# EAGLE schematic Opentrons_smoothieboard-5driver (EAGLE 7.2.0)

## Sheet 1 of 4
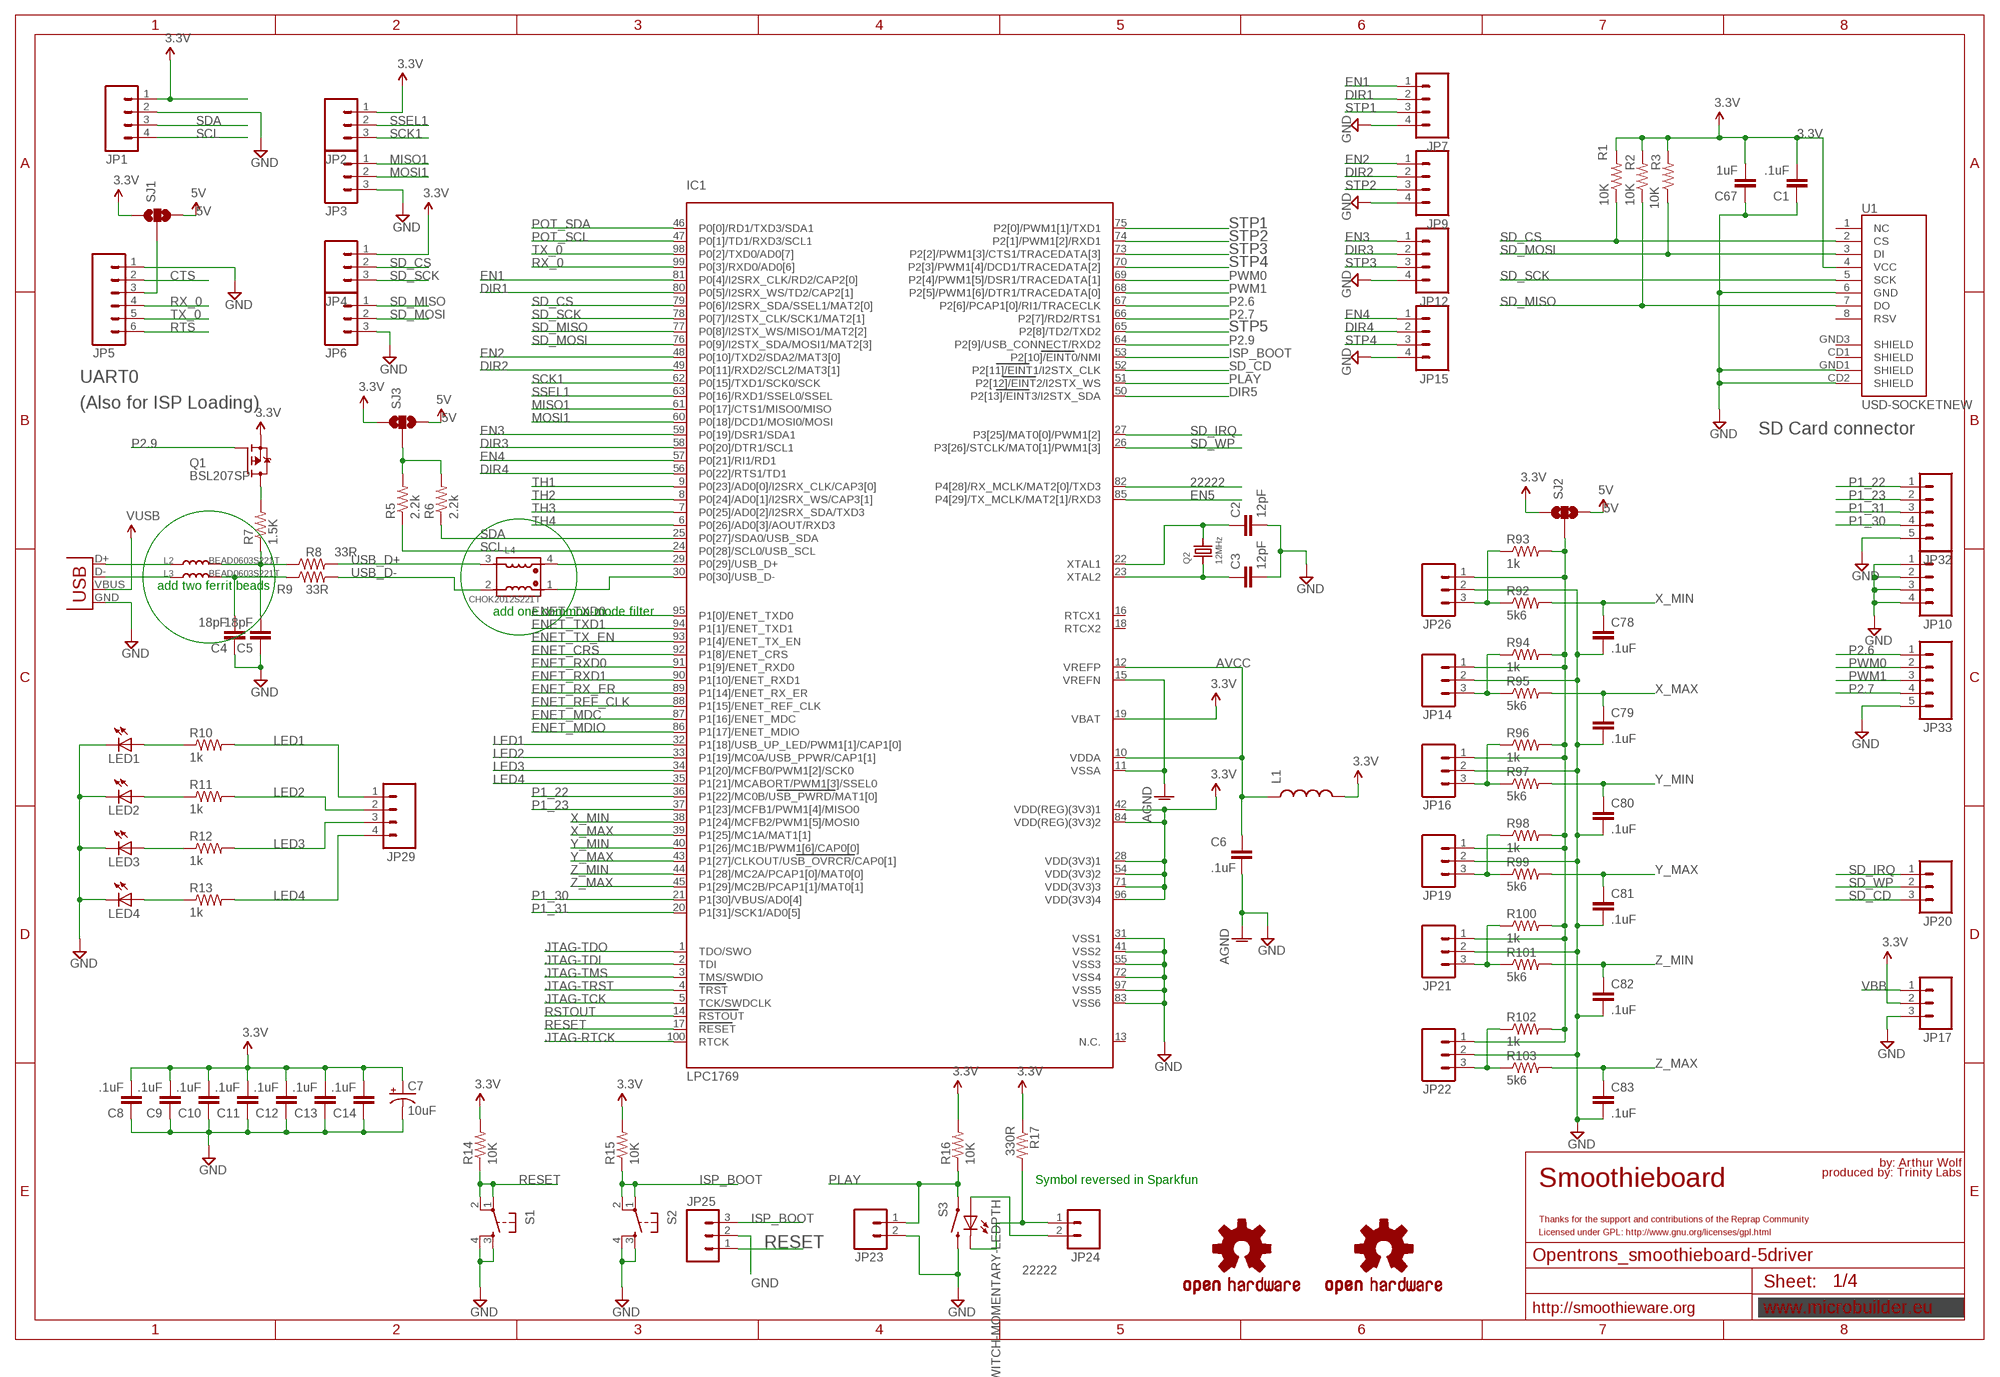
[diagram p0: schematic, sheet 1]

### Parts
C1  .1uF  C-EUC0603  [C0603]
C2  12pF  C-EUC0603  [C0603]
C3  12pF  C-EUC0603  [C0603]
C4  18pF  C-EUC0603  [C0603]
C5  18pF  C-EUC0603  [C0603]
C6  .1uF  C-EUC0603  [C0603]
C7  10uF  CAP_POL1206  [EIA3216]
C8  .1uF  C-EUC0603  [C0603]
C9  .1uF  C-EUC0603  [C0603]
C10  .1uF  C-EUC0603  [C0603]
C11  .1uF  C-EUC0603  [C0603]
C12  .1uF  C-EUC0603  [C0603]
C13  .1uF  C-EUC0603  [C0603]
C14  .1uF  C-EUC0603  [C0603]
C67  1uF  C-EUC0805  [C0805]
C78  .1uF  C-EUC0603  [C0603]
C79  .1uF  C-EUC0603  [C0603]
C80  .1uF  C-EUC0603  [C0603]
C81  .1uF  C-EUC0603  [C0603]
C82  .1uF  C-EUC0603  [C0603]
C83  .1uF  C-EUC0603  [C0603]
IC1  LPC1769  LPC1768  [LQFP100]
JP1  M041X04_NO_SILK  [1X04_NO_SILK]
JP2  M031X03_NO_SILK  [1X03_NO_SILK]
JP3  M031X03_NO_SILK  [1X03_NO_SILK]
JP4  M031X03_NO_SILK  [1X03_NO_SILK]
JP5  M06POLAR  [MOLEX-1X6]
JP6  M031X03_NO_SILK  [1X03_NO_SILK]
JP7  M041X04_NO_SILK  [1X04_NO_SILK]
JP9  M041X04_NO_SILK  [1X04_NO_SILK]
JP10  M041X04_NO_SILK  [1X04_NO_SILK]
JP12  M041X04_NO_SILK  [1X04_NO_SILK]
JP14  M03POLAR  [MOLEX-1X3]
JP15  M041X04_NO_SILK  [1X04_NO_SILK]
JP16  M03POLAR  [MOLEX-1X3]
JP17  M03PTH  [1X03]
JP19  M03POLAR  [MOLEX-1X3]
JP20  M03PTH  [1X03]
JP21  M03POLAR  [MOLEX-1X3]
JP22  M03POLAR  [MOLEX-1X3]
JP23  M02PTH  [1X02]
JP24  M02PTH  [1X02]
JP25  M03PTH  [1X03]
JP26  M03POLAR  [MOLEX-1X3]
JP29  M041X04_NO_SILK  [1X04_NO_SILK]
JP32  M05PTH  [1X05]
JP33  M05PTH  [1X05]
L1  INDUCTOR0603  [0603]
L2  BEAD0603S221T  INDOUCTOR0603  [0603(1608)]
L3  BEAD0603S221T  INDOUCTOR0603  [0603(1608)]
L4  CHOK2012S221T  CHOK-2012S-XXXT  [L-2012]
LED1  LEDCHIP-LED0805  [CHIP-LED0805]
LED2  LEDCHIP-LED0805  [CHIP-LED0805]
LED3  LEDCHIP-LED0805  [CHIP-LED0805]
LED4  LEDCHIP-LED0805  [CHIP-LED0805]
Q1  BSL207SP  [SC74_INFINEON]
Q2  12MHz  CRYSTALTHIN  [CRYSTAL_3.2X2.5]
R1  10K  R-US_R0603  [R0603]
R2  10K  R-US_R0603  [R0603]
R3  10K  R-US_R0603  [R0603]
R5  2.2k  R-US_R0603  [R0603]
R6  2.2k  R-US_R0603  [R0603]
R7  1.5K  R-US_R0603  [R0603]
R8  33R  R-US_R0603  [R0603]
R9  33R  R-US_R0603  [R0603]
R10  1k  R-US_R0603  [R0603]
R11  1k  R-US_R0603  [R0603]
R12  1k  R-US_R0603  [R0603]
R13  1k  R-US_R0603  [R0603]
R14  10K  R-US_R0603  [R0603]
R15  10K  R-US_R0603  [R0603]
R16  10K  R-US_R0603  [R0603]
R17  330R  R-US_R0603  [R0603]
R92  5k6  R-US_R0603  [R0603]
R93  1k  R-US_R0603  [R0603]
R94  1k  R-US_R0603  [R0603]
R95  5k6  R-US_R0603  [R0603]
R96  1k  R-US_R0603  [R0603]
R97  5k6  R-US_R0603  [R0603]
R98  1k  R-US_R0603  [R0603]
R99  5k6  R-US_R0603  [R0603]
R100  1k  R-US_R0603  [R0603]
R101  5k6  R-US_R0603  [R0603]
R102  1k  R-US_R0603  [R0603]
R103  5k6  R-US_R0603  [R0603]
S1  TAC_SWITCHSMD  [TACTILE_SWITCH_SMD]
S2  TAC_SWITCHSMD  [TACTILE_SWITCH_SMD]
S3  SWITCH-MOMENTARY-LEDPTH  [TACTILE-PTH-LED-12MM]
SJ1  SOLDERJUMPER_2WAYS  [SJ_3]
SJ2  SOLDERJUMPER_2WAYS  [SJ_3]
SJ3  SOLDERJUMPER_2WAYS  [SJ_3]
U1  USD-SOCKETNEW  [MICRO-SD-SOCKET-PP]
U$8  OSHW-LOGOH  [OSHW-LOGO-HUGE]
U$9  OSHW-LOGOH  [OSHW-LOGO-HUGE]
X14  USBPTH  [USB-B-PTH]

### Nets
3.3V: C1.2 C7.A(+) C8.2 C9.2 C10.2 C11.2 C12.2 C13.2 C14.2 C67.2 IC1.19(VBAT) IC1.28(VDD(3V3)1) IC1.42(VDD(REG)(3V3)1) IC1.54(VDD(3V3)2) IC1.71(VDD(3V3)3) IC1.84(VDD(REG)(3V3)2) IC1.96(VDD(3V3)4) JP1.1 JP2.1 JP4.1 JP17.2 L1.2 Q1.4(S) R1.2 R2.2 R3.2 R14.2 R15.2 R16.2 R17.1 SJ1.1 SJ2.1 SJ3.1 U1.4(VCC) ; also sheet 2,3,4
5V: SJ1.3 SJ2.3 SJ3.3 ; also sheet 3
22222: IC1.82(P4[28]/RX_MCLK/MAT2[0]/TXD3) JP24.2 S3.A
AGND: C6.2 IC1.11(VSSA) IC1.15(VREFN) ; supply symbol labelled GND ; also sheet 2
AVCC: C6.1 IC1.10(VDDA) IC1.12(VREFP) L1.1 ; also sheet 2
CTS: JP5.2
DIR1: IC1.80(P0[5]/I2SRX_WS/TD2/CAP2[1]) JP7.2 ; also sheet 2
DIR2: IC1.49(P0[11]/RXD2/SCL2/MAT3[1]) JP9.2 ; also sheet 2
DIR3: IC1.58(P0[20]/DTR1/SCL1) JP12.2 ; also sheet 2
DIR4: IC1.56(P0[22]/RTS1/TD1) JP15.2 ; also sheet 2
DIR5: IC1.50(P2[13]/EINT3/I2STX_SDA) ; also sheet 4
EN1: IC1.81(P0[4]/I2SRX_CLK/RD2/CAP2[0]) JP7.1 ; also sheet 2
EN2: IC1.48(P0[10]/TXD2/SDA2/MAT3[0]) JP9.1 ; also sheet 2
EN3: IC1.59(P0[19]/DSR1/SDA1) JP12.1 ; also sheet 2
EN4: IC1.57(P0[21]/RI1/RD1) JP15.1 ; also sheet 2
EN5: IC1.85(P4[29]/TX_MCLK/MAT2[1]/RXD3) ; also sheet 4
ENET_CRS: IC1.92(P1[8]/ENET_CRS) ; also sheet 3
ENET_MDC: IC1.87(P1[16]/ENET_MDC) ; also sheet 3
ENET_MDIO: IC1.86(P1[17]/ENET_MDIO) ; also sheet 3
ENET_REF_CLK: IC1.88(P1[15]/ENET_REF_CLK) ; also sheet 3
ENET_RX_ER: IC1.89(P1[14]/ENET_RX_ER) ; also sheet 3
ENET_RXD0: IC1.91(P1[9]/ENET_RXD0) ; also sheet 3
ENET_RXD1: IC1.90(P1[10]/ENET_RXD1) ; also sheet 3
ENET_TX_EN: IC1.93(P1[4]/ENET_TX_EN) ; also sheet 3
ENET_TXD0: IC1.95(P1[0]/ENET_TXD0) ; also sheet 3
ENET_TXD1: IC1.94(P1[1]/ENET_TXD1) ; also sheet 3
GND: C1.1 C2.2 C3.2 C4.1 C5.1 C7.C(-) C8.1 C9.1 C10.1 C11.1 C12.1 C13.1 C14.1 C67.1 C78.2 C79.2 C80.2 C81.2 C82.2 C83.2 IC1.31(VSS1) IC1.41(VSS2) IC1.55(VSS3) IC1.72(VSS4) IC1.83(VSS6) IC1.97(VSS5) JP1.2 JP3.3 JP5.1 JP6.3 JP7.4 JP9.4 JP10.1 JP10.2 JP10.3 JP10.4 JP12.4 JP14.2 JP15.4 JP16.2 JP17.3 JP19.2 JP21.2 JP22.2 JP23.2 JP25.2 JP26.2 JP32.5 JP33.5 LED1.C LED2.C LED3.C LED4.C S1.3 S1.4 S2.3 S2.4 S3.2 U1.6(GND) U1.CD2(SHIELD) U1.GND1(SHIELD) X14.GND ; also sheet 2,3,4
ISP_BOOT: IC1.53(P2[10]/EINT0/NMI) JP25.3 R15.1 S2.1 S2.2
JTAG-RTCK: IC1.100(RTCK)
JTAG-TCK: IC1.5(TCK/SWDCLK)
JTAG-TDI: IC1.2(TDI)
JTAG-TDO: IC1.1(TDO/SWO)
JTAG-TMS: IC1.3(TMS/SWDIO)
JTAG-TRST: IC1.4(TRST)
LED1: IC1.32(P1[18]/USB_UP_LED/PWM1[1]/CAP1[0]) JP29.1 R10.2
LED2: IC1.33(P1[19]/MC0A/USB_PPWR/CAP1[1]) JP29.2 R11.2
LED3: IC1.34(P1[20]/MCFB0/PWM1[2]/SCK0) JP29.3 R12.2
LED4: IC1.35(P1[21]/MCABORT/PWM1[3]/SSEL0) JP29.4 R13.2
MISO1: IC1.61(P0[17]/CTS1/MISO0/MISO) JP3.1
MOSI1: IC1.60(P0[18]/DCD1/MOSI0/MOSI) JP3.2
N$1: C2.1 IC1.22(XTAL1) Q2.2
N$2: C3.1 IC1.23(XTAL2) Q2.1
N$23: JP5.3 SJ1.2
N$51: Q1.1(D) Q1.2(D) Q1.5(D) Q1.6(D) R7.2
N$61: L2.1 X14.D+
N$62: L3.1 X14.D-
N$73: JP24.1 R17.2 S3.C
N$84: LED4.A R13.1
N$85: LED3.A R12.1
N$86: LED2.A R11.1
N$87: LED1.A R10.1
N$114: JP14.3 R94.1 R95.1
N$115: JP14.1 JP16.1 JP19.1 JP21.1 JP22.1 JP26.1 R93.2 R94.2 R96.2 R98.2 R100.2 R102.2 SJ2.2
N$116: JP16.3 R96.1 R97.1
N$117: JP19.3 R98.1 R99.1
N$118: JP22.3 R102.1 R103.1
N$119: JP21.3 R100.1 R101.1
N$122: JP26.3 R92.1 R93.1
N$124: R5.2 R6.2 SJ3.2
N$125: C5.2 L2.2 R7.1 R8.1
N$126: C4.2 L3.2 R9.1
N$128: IC1.30(P0[30]/USB_D-) L4.1
N$153: IC1.29(P0[29]/USB_D+) L4.4
P1_22: IC1.36(P1[22]/MC0B/USB_PWRD/MAT1[0]) JP32.1 ; also sheet 4
P1_23: IC1.37(P1[23]/MCFB1/PWM1[4]/MISO0) JP32.2 ; also sheet 4
P1_30: IC1.21(P1[30]/VBUS/AD0[4]) JP32.4
P1_31: IC1.20(P1[31]/SCK1/AD0[5]) JP32.3
P2.6: IC1.67(P2[6]/PCAP1[0]/RI1/TRACECLK) JP33.1 ; also sheet 3
P2.7: IC1.66(P2[7]/RD2/RTS1) JP33.4 ; also sheet 3
P2.9: IC1.64(P2[9]/USB_CONNECT/RXD2) Q1.3(G)
PLAY: IC1.51(P2[12]/EINT2/I2STX_WS) JP23.1 R16.1 S3.4
POT_SCL: IC1.47(P0[1]/TD1/RXD3/SCL1) ; also sheet 2,4
POT_SDA: IC1.46(P0[0]/RD1/TXD3/SDA1) ; also sheet 2,4
PWM0: IC1.69(P2[4]/PWM1[5]/DSR1/TRACEDATA[1]) JP33.2 ; also sheet 3
PWM1: IC1.68(P2[5]/PWM1[6]/DTR1/TRACEDATA[0]) JP33.3 ; also sheet 3
RESET: IC1.17(RESET) JP25.1 R14.1 S1.1 S1.2
RSTOUT: IC1.14(RSTOUT) ; also sheet 3
RTS: JP5.6
RX_0: IC1.99(P0[3]/RXD0/AD0[6]) JP5.4
SCK1: IC1.62(P0[15]/TXD1/SCK0/SCK) JP2.3
SCL: IC1.24(P0[28]/SCL0/USB_SCL) JP1.4 R5.1
SD_CD: IC1.52(P2[11]/EINT1/I2STX_CLK) JP20.3
SD_CS: IC1.79(P0[6]/I2SRX_SDA/SSEL1/MAT2[0]) JP4.2 R1.1 U1.2(CS)
SD_IRQ: IC1.27(P3[25]/MAT0[0]/PWM1[2]) JP20.1
SD_MISO: IC1.77(P0[8]/I2STX_WS/MISO1/MAT2[2]) JP6.1 R2.1 U1.7(DO)
SD_MOSI: IC1.76(P0[9]/I2STX_SDA/MOSI1/MAT2[3]) JP6.2 R3.1 U1.3(DI)
SD_SCK: IC1.78(P0[7]/I2STX_CLK/SCK1/MAT2[1]) JP4.3 U1.5(SCK)
SD_WP: IC1.26(P3[26]/STCLK/MAT0[1]/PWM1[3]) JP20.2
SDA: IC1.25(P0[27]/SDA0/USB_SDA) JP1.3 R6.1
SSEL1: IC1.63(P0[16]/RXD1/SSEL0/SSEL) JP2.2
STP1: IC1.75(P2[0]/PWM1[1]/TXD1) JP7.3 ; also sheet 2
STP2: IC1.74(P2[1]/PWM1[2]/RXD1) JP9.3 ; also sheet 2
STP3: IC1.73(P2[2]/PWM1[3]/CTS1/TRACEDATA[3]) JP12.3 ; also sheet 2
STP4: IC1.70(P2[3]/PWM1[4]/DCD1/TRACEDATA[2]) JP15.3 ; also sheet 2
STP5: IC1.65(P2[8]/TD2/TXD2) ; also sheet 4
TH1: IC1.9(P0[23]/AD0[0]/I2SRX_CLK/CAP3[0]) ; also sheet 2
TH2: IC1.8(P0[24]/AD0[1]/I2SRX_WS/CAP3[1]) ; also sheet 2
TH3: IC1.7(P0[25]/AD0[2]/I2SRX_SDA/TXD3) ; also sheet 2
TH4: IC1.6(P0[26]/AD0[3]/AOUT/RXD3) ; also sheet 2
TX_0: IC1.98(P0[2]/TXD0/AD0[7]) JP5.5
USB_D+: L4.3 R8.2
USB_D-: L4.2 R9.2
VBB: JP17.1 ; also sheet 2,3,4
VUSB: X14.VBUS ; also sheet 3
X_MAX: C79.1 IC1.39(P1[25]/MC1A/MAT1[1]) R95.2
X_MIN: C78.1 IC1.38(P1[24]/MCFB2/PWM1[5]/MOSI0) R92.2
Y_MAX: C81.1 IC1.43(P1[27]/CLKOUT/USB_OVRCR/CAP0[1]) R99.2
Y_MIN: C80.1 IC1.40(P1[26]/MC1B/PWM1[6]/CAP0[0]) R97.2
Z_MAX: C83.1 IC1.45(P1[29]/MC2B/PCAP1[1]/MAT0[1]) R103.2
Z_MIN: C82.1 IC1.44(P1[28]/MC2A/PCAP1[0]/MAT0[0]) R101.2
Unconnected: IC1.13(N.C.) IC1.16(RTCX1) IC1.18(RTCX2) U1.1(NC) U1.8(RSV) U1.CD1(SHIELD) U1.GND3(SHIELD)

### Notes on the sheet
- UART0
- (Also for ISP Loading)
- SD Card connector
- add two ferrit beads
- add one common-mode filter
- by: Arthur Wolf
- produced by: Trinity Labs
- Symbol reversed in Sparkfun | Smoothieboard
- Thanks for the support and contributions of the Reprap Community
- Licensed under GPL: http://www.gnu.org/licenses/gpl.html
- http://smoothieware.org

## Sheet 2 of 4
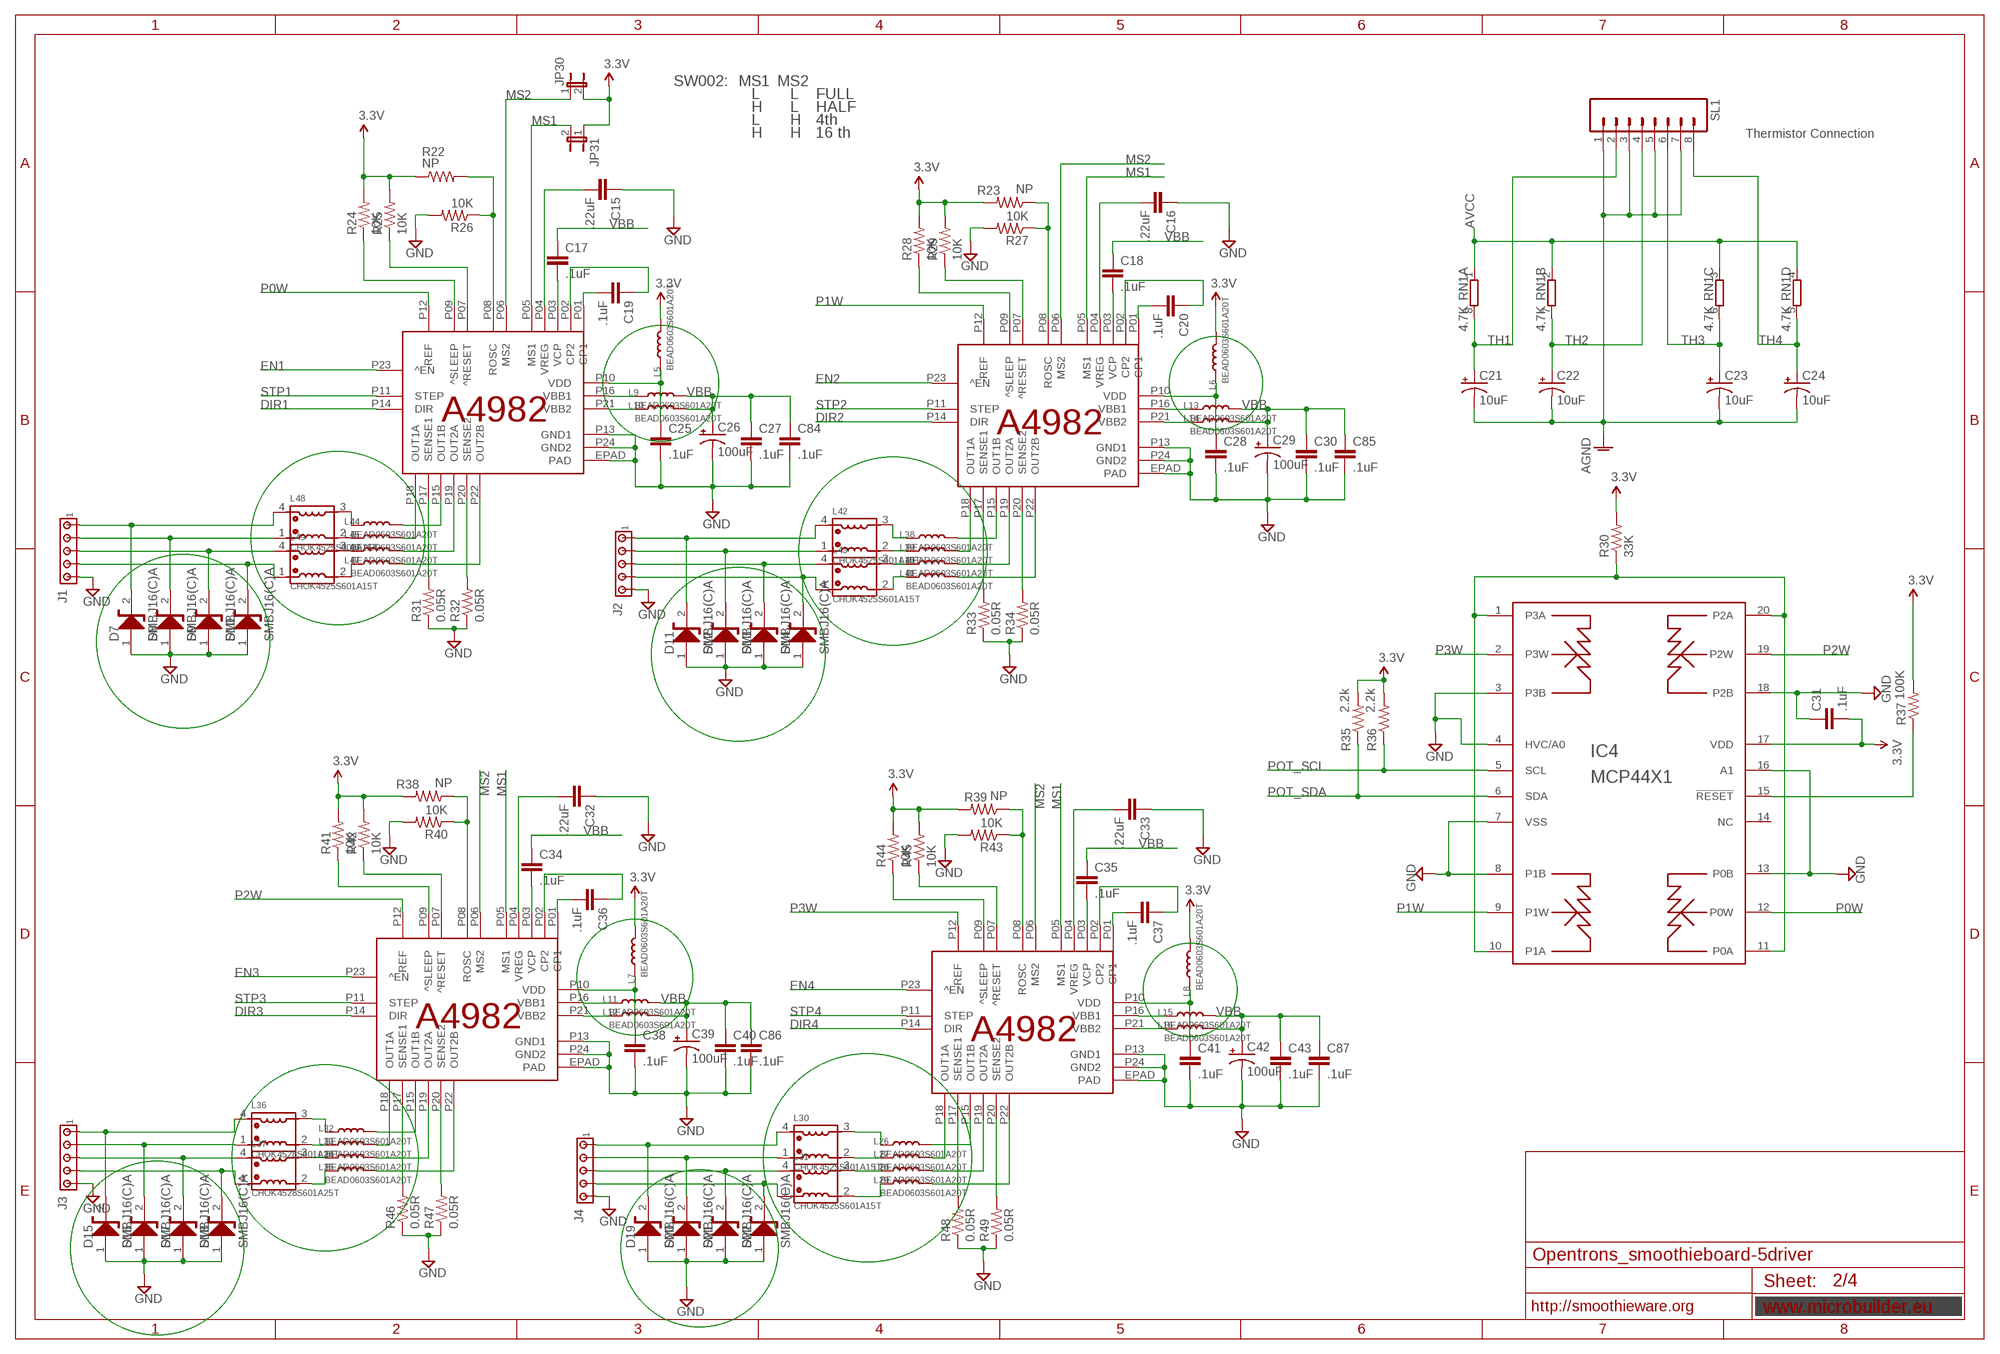
[diagram p1: schematic, sheet 2]

### Parts
C15  .22uF  C-EUC0603  [C0603]
C16  .22uF  C-EUC0603  [C0603]
C17  .1uF  C-EUC0603  [C0603]
C18  .1uF  C-EUC0603  [C0603]
C19  .1uF  C-EUC0603  [C0603]
C20  .1uF  C-EUC0603  [C0603]
C21  10uF  CAP_POL1206  [EIA3216]
C22  10uF  CAP_POL1206  [EIA3216]
C23  10uF  CAP_POL1206  [EIA3216]
C24  10uF  CAP_POL1206  [EIA3216]
C25  .1uF  C-EUC0603  [C0603]
C26  100uF  CAP_POLE  [PANASONIC_E]
C27  .1uF  C-EUC0603  [C0603]
C28  .1uF  C-EUC0603  [C0603]
C29  100uF  CAP_POLE  [PANASONIC_E]
C30  .1uF  C-EUC0603  [C0603]
C31  .1uF  C-EUC0603  [C0603]
C32  .22uF  C-EUC0603  [C0603]
C33  .22uF  C-EUC0603  [C0603]
C34  .1uF  C-EUC0603  [C0603]
C35  .1uF  C-EUC0603  [C0603]
C36  .1uF  C-EUC0603  [C0603]
C37  .1uF  C-EUC0603  [C0603]
C38  .1uF  C-EUC0603  [C0603]
C39  100uF  CAP_POLE  [PANASONIC_E]
C40  .1uF  C-EUC0603  [C0603]
C41  .1uF  C-EUC0603  [C0603]
C42  100uF  CAP_POLE  [PANASONIC_E]
C43  .1uF  C-EUC0603  [C0603]
C84  .1uF  C-EUC0603  [C0603]
C85  .1uF  C-EUC0603  [C0603]
C86  .1uF  C-EUC0603  [C0603]
C87  .1uF  C-EUC0603  [C0603]
D7  SMBJ16(C)A  [DO214-AA_(SMB)]
D8  SMBJ16(C)A  [DO214-AA_(SMB)]
D9  SMBJ16(C)A  [DO214-AA_(SMB)]
D10  SMBJ16(C)A  [DO214-AA_(SMB)]
D11  SMBJ16(C)A  [DO214-AA_(SMB)]
D12  SMBJ16(C)A  [DO214-AA_(SMB)]
D13  SMBJ16(C)A  [DO214-AA_(SMB)]
D14  SMBJ16(C)A  [DO214-AA_(SMB)]
D15  SMBJ16(C)A  [DO214-AA_(SMB)]
D16  SMBJ16(C)A  [DO214-AA_(SMB)]
D17  SMBJ16(C)A  [DO214-AA_(SMB)]
D18  SMBJ16(C)A  [DO214-AA_(SMB)]
D19  SMBJ16(C)A  [DO214-AA_(SMB)]
D20  SMBJ16(C)A  [DO214-AA_(SMB)]
D21  SMBJ16(C)A  [DO214-AA_(SMB)]
D22  SMBJ16(C)A  [DO214-AA_(SMB)]
IC2  A4982  [ETSSOP24]
IC3  A4982  [ETSSOP24]
IC4  MCP44X1  [TSSOP20]
IC5  A4982  [ETSSOP24]
IC6  A4982  [ETSSOP24]
J1  MTA05-100  [10X05MTA]
J2  MTA05-100  [10X05MTA]
J3  MTA05-100  [10X05MTA]
J4  MTA05-100  [10X05MTA]
JP30  JUMPER-2SMD-NC  [SJ_2S]
JP31  JUMPER-2SMD-NC  [SJ_2S]
L5  BEAD0603S601A20T  INDOUCTOR0603  [0603(1608)]
L6  BEAD0603S601A20T  INDOUCTOR0603  [0603(1608)]
L7  BEAD0603S601A20T  INDOUCTOR0603  [0603(1608)]
L8  BEAD0603S601A20T  INDOUCTOR0603  [0603(1608)]
L9  BEAD0603S601A20T  INDOUCTOR0603  [0603(1608)]
L10  BEAD0603S601A20T  INDOUCTOR0603  [0603(1608)]
L11  BEAD0603S601A20T  INDOUCTOR0603  [0603(1608)]
L12  BEAD0603S601A20T  INDOUCTOR0603  [0603(1608)]
L13  BEAD0603S601A20T  INDOUCTOR0603  [0603(1608)]
L14  BEAD0603S601A20T  INDOUCTOR0603  [0603(1608)]
L15  BEAD0603S601A20T  INDOUCTOR0603  [0603(1608)]
L16  BEAD0603S601A20T  INDOUCTOR0603  [0603(1608)]
L26  BEAD0603S601A20T  INDOUCTOR0603  [0603(1608)]
L27  BEAD0603S601A20T  INDOUCTOR0603  [0603(1608)]
L28  BEAD0603S601A20T  INDOUCTOR0603  [0603(1608)]
L29  BEAD0603S601A20T  INDOUCTOR0603  [0603(1608)]
L30  CHOK4525S601A15T  CHOK-4525S-XXX  [L-4525]
L31  CHOK4525S601A15T  CHOK-4525S-XXX  [L-4525]
L32  BEAD0603S601A20T  INDOUCTOR0603  [0603(1608)]
L33  BEAD0603S601A20T  INDOUCTOR0603  [0603(1608)]
L34  BEAD0603S601A20T  INDOUCTOR0603  [0603(1608)]
L35  BEAD0603S601A20T  INDOUCTOR0603  [0603(1608)]
L36  CHOK4528S601A25T  CHOK-4528S-XXX  [L-4528]
L37  CHOK4528S601A25T  CHOK-4528S-XXX  [L-4528]
L38  BEAD0603S601A20T  INDOUCTOR0603  [0603(1608)]
L39  BEAD0603S601A20T  INDOUCTOR0603  [0603(1608)]
L40  BEAD0603S601A20T  INDOUCTOR0603  [0603(1608)]
L41  BEAD0603S601A20T  INDOUCTOR0603  [0603(1608)]
L42  CHOK4525S601A15T  CHOK-4525S-XXX  [L-4525]
L43  CHOK4525S601A15T  CHOK-4525S-XXX  [L-4525]
L44  BEAD0603S601A20T  INDOUCTOR0603  [0603(1608)]
L45  BEAD0603S601A20T  INDOUCTOR0603  [0603(1608)]
L46  BEAD0603S601A20T  INDOUCTOR0603  [0603(1608)]
L47  BEAD0603S601A20T  INDOUCTOR0603  [0603(1608)]
L48  CHOK4525S601A15T  CHOK-4525S-XXX  [L-4525]
L49  CHOK4525S601A15T  CHOK-4525S-XXX  [L-4525]
R22  NP  R-US_R0603  [R0603]
R23  NP  R-US_R0603  [R0603]
R24  10K  R-US_R0603  [R0603]
R25  10K  R-US_R0603  [R0603]
R26  10K  R-US_R0603  [R0603]
R27  10K  R-US_R0603  [R0603]
R28  10K  R-US_R0603  [R0603]
R29  10K  R-US_R0603  [R0603]
R30  33K  R-US_R0603  [R0603]
R31  0.05R  RESISTOR2512  [R2512]
R32  0.05R  RESISTOR2512  [R2512]
R33  0.05R  RESISTOR2512  [R2512]
R34  0.05R  RESISTOR2512  [R2512]
R35  2.2k  R-US_R0603  [R0603]
R36  2.2k  R-US_R0603  [R0603]
R37  100K  R-US_R0603  [R0603]
R38  NP  R-US_R0603  [R0603]
R39  NP  R-US_R0603  [R0603]
R40  10K  R-US_R0603  [R0603]
R41  10K  R-US_R0603  [R0603]
R42  10K  R-US_R0603  [R0603]
R43  10K  R-US_R0603  [R0603]
R44  10K  R-US_R0603  [R0603]
R45  10K  R-US_R0603  [R0603]
R46  0.05R  RESISTOR2512  [R2512]
R47  0.05R  RESISTOR2512  [R2512]
R48  0.05R  RESISTOR2512  [R2512]
R49  0.05R  RESISTOR2512  [R2512]
RN1  4.7K  4R-N0603-ARV  [0603-ARV]
SL1  M08  [08P]

### Nets
3.3V: C31.2 IC4.17(VDD) JP30.2 JP31.1 L5.2 L6.2 L7.2 L8.2 R22.1 R23.2 R24.2 R25.2 R28.2 R29.2 R30.2 R35.2 R36.2 R37.2 R38.2 R39.2 R41.2 R42.2 R44.2 R45.2 ; also sheet 1,3,4
AGND: C21.C(-) C22.C(-) C23.C(-) C24.C(-) SL1.1 SL1.3 SL1.5 SL1.7 ; also sheet 1
AVCC: RN1.1 RN1.2 RN1.3 RN1.4 ; also sheet 1
DIR1: IC2.P14(DIR) ; also sheet 1
DIR2: IC3.P14(DIR) ; also sheet 1
DIR3: IC5.P14(DIR) ; also sheet 1
DIR4: IC6.P14(DIR) ; also sheet 1
EN1: IC2.P23(^EN) ; also sheet 1
EN2: IC3.P23(^EN) ; also sheet 1
EN3: IC5.P23(^EN) ; also sheet 1
EN4: IC6.P23(^EN) ; also sheet 1
GND: C15.1 C16.1 C25.2 C26.- C27.2 C28.2 C29.- C30.2 C31.1 C32.1 C33.1 C38.2 C39.- C40.2 C41.2 C42.- C43.2 C84.2 C85.2 C86.2 C87.2 D7.1(A) D8.1(A) D9.1(A) D10.1(A) D11.1(A) D12.1(A) D13.1(A) D14.1(A) D15.1(A) D16.1(A) D17.1(A) D18.1(A) D19.1(A) D20.1(A) D21.1(A) D22.1(A) IC2.EPAD(PAD) IC2.P13(GND1) IC2.P24(GND2) IC3.EPAD(PAD) IC3.P13(GND1) IC3.P24(GND2) IC4.3(P3B) IC4.4(HVC/A0) IC4.7(VSS) IC4.8(P1B) IC4.13(P0B) IC4.16(A1) IC4.18(P2B) IC5.EPAD(PAD) IC5.P13(GND1) IC5.P24(GND2) IC6.EPAD(PAD) IC6.P13(GND1) IC6.P24(GND2) J1.5 J2.5 J3.5 J4.5 R26.2 R27.2 R31.1 R32.1 R33.1 R34.1 R40.2 R43.2 R46.1 R47.1 R48.1 R49.1 ; also sheet 1,3,4
J1_1A: D7.2(K) J1.1 L48.4
J1_1B: D8.2(K) J1.2 L48.1
J1_2A: D9.2(K) J1.3 L49.4
J1_2B: D10.2(K) J1.4 L49.1
J2_1A: D11.2(K) J2.1 L42.4
J2_1B: D12.2(K) J2.2 L42.1
J2_2A: D13.2(K) J2.3 L43.4
J2_2B: D14.2(K) J2.4 L43.1
J3_1A: D15.2(K) J3.1 L36.4
J3_1B: D16.2(K) J3.2 L36.1
J3_2A: D17.2(K) J3.3 L37.4
J3_2B: D18.2(K) J3.4 L37.1
J4_1A: D19.2(K) J4.1 L30.4
J4_1B: D20.2(K) J4.2 L30.1
J4_2A: D21.2(K) J4.3 L31.4
J4_2B: D22.2(K) J4.4 L31.1
MS1: IC2.P05(MS1) IC3.P05(MS1) IC5.P05(MS1) IC6.P05(MS1) JP31.2 ; also sheet 4
MS2: IC2.P06(MS2) IC3.P06(MS2) IC5.P06(MS2) IC6.P06(MS2) JP30.1 ; also sheet 4
N$3: C20.2 IC3.P01(CP1)
N$4: C20.1 IC3.P02(CP2)
N$6: IC2.P07(^RESET) R25.1
N$7: C18.2 IC3.P03(VCP)
N$8: IC3.P17(SENSE1) R33.2
N$9: IC3.P20(SENSE2) R34.2
N$10: IC3.P18(OUT1A) L39.2
N$12: IC3.P19(OUT2A) L40.2
N$13: IC4.15(!RESET) R37.1
N$14: IC3.P22(OUT2B) L41.2
N$15: IC4.1(P3A) IC4.10(P1A) IC4.11(P0A) IC4.20(P2A) R30.1
N$17: IC3.P08(ROSC) R23.1 R27.1
N$22: C16.2 IC3.P04(VREG)
N$24: IC3.P09(^SLEEP) R28.1
N$25: C36.2 IC5.P01(CP1)
N$26: C36.1 IC5.P02(CP2)
N$27: C34.2 IC5.P03(VCP)
N$28: IC5.P17(SENSE1) R46.2
N$30: IC5.P20(SENSE2) R47.2
N$31: IC5.P18(OUT1A) L33.2
N$32: IC5.P15(OUT1B) L32.2
N$33: IC5.P19(OUT2A) L34.2
N$34: IC5.P22(OUT2B) L35.2
N$35: IC3.P07(^RESET) R29.1
N$36: IC5.P07(^RESET) R42.1
N$37: IC5.P08(ROSC) R38.1 R40.1
N$38: C32.2 IC5.P04(VREG)
N$39: IC6.P07(^RESET) R45.1
N$40: IC5.P09(^SLEEP) R41.1
N$41: C37.2 IC6.P01(CP1)
N$43: C37.1 IC6.P02(CP2)
N$44: C35.2 IC6.P03(VCP)
N$45: IC6.P17(SENSE1) R48.2
N$46: IC6.P20(SENSE2) R49.2
N$48: IC6.P15(OUT1B) L26.2
N$49: IC6.P19(OUT2A) L28.2
N$50: IC6.P22(OUT2B) L29.2
N$53: IC6.P08(ROSC) R39.1 R43.1
N$54: C33.2 IC6.P04(VREG)
N$57: IC6.P09(^SLEEP) R44.1
N$60: IC6.P18(OUT1A) L27.2
N$90: C19.2 IC2.P01(CP1)
N$93: C19.1 IC2.P02(CP2)
N$96: C17.2 IC2.P03(VCP)
N$98: IC2.P17(SENSE1) R31.2
N$99: IC2.P20(SENSE2) R32.2
N$101: IC2.P18(OUT1A) L45.2
N$102: IC2.P15(OUT1B) L44.2
N$103: IC2.P19(OUT2A) L46.2
N$104: IC2.P22(OUT2B) L47.2
N$106: IC2.P08(ROSC) R22.2 R26.1
N$107: C15.2 IC2.P04(VREG)
N$108: IC2.P09(^SLEEP) R24.1
N$129: C25.1 IC2.P10(VDD) L5.1
N$130: C38.1 IC5.P10(VDD) L7.1
N$131: C28.1 IC3.P10(VDD) L6.1
N$132: C41.1 IC6.P10(VDD) L8.1
N$133: IC2.P16(VBB1) L9.1
N$134: IC2.P21(VBB2) L10.1
N$135: IC3.P16(VBB1) L13.1
N$136: IC3.P21(VBB2) L14.1
N$137: IC5.P16(VBB1) L11.1
N$138: IC5.P21(VBB2) L12.1
N$139: IC6.P16(VBB1) L15.1
N$140: IC6.P21(VBB2) L16.1
N$154: L26.1 L30.3
N$155: L27.1 L30.2
N$156: L28.1 L31.3
N$157: L29.1 L31.2
N$160: L33.1 L36.2
N$161: L34.1 L37.3
N$166: L32.1 L36.3
N$167: L35.1 L37.2
N$170: IC3.P15(OUT1B) L38.2
N$172: L40.1 L43.3
N$173: L39.1 L42.2
N$174: L41.1 L43.2
N$175: L38.1 L42.3
N$176: L45.1 L48.2
N$177: L46.1 L49.3
N$182: L44.1 L48.3
N$183: L47.1 L49.2
P0W: IC2.P12(REF) IC4.12(P0W)
P1W: IC3.P12(REF) IC4.9(P1W)
P2W: IC4.19(P2W) IC5.P12(REF)
P3W: IC4.2(P3W) IC6.P12(REF)
POT_SCL: IC4.5(SCL) R36.1 ; also sheet 1,4
POT_SDA: IC4.6(SDA) R35.1 ; also sheet 1,4
STP1: IC2.P11(STEP) ; also sheet 1
STP2: IC3.P11(STEP) ; also sheet 1
STP3: IC5.P11(STEP) ; also sheet 1
STP4: IC6.P11(STEP) ; also sheet 1
TH1: C21.A(+) RN1.8 SL1.2 ; also sheet 1
TH2: C22.A(+) RN1.7 SL1.4 ; also sheet 1
TH3: C23.A(+) RN1.6 SL1.6 ; also sheet 1
TH4: C24.A(+) RN1.5 SL1.8 ; also sheet 1
VBB: C17.1 C18.1 C26.+ C27.1 C29.+ C30.1 C34.1 C35.1 C39.+ C40.1 C42.+ C43.1 C84.1 C85.1 C86.1 C87.1 L9.2 L10.2 L11.2 L12.2 L13.2 L14.2 L15.2 L16.2 ; also sheet 1,3,4
Unconnected: IC4.14(NC)

### Notes on the sheet
- SW002: | MS1 | MS2
- L | L | FULL
- H | L | HALF
- L | H | 4th
- H | H | 16 th | Thermistor Connection
- http://smoothieware.org

## Sheet 3 of 4
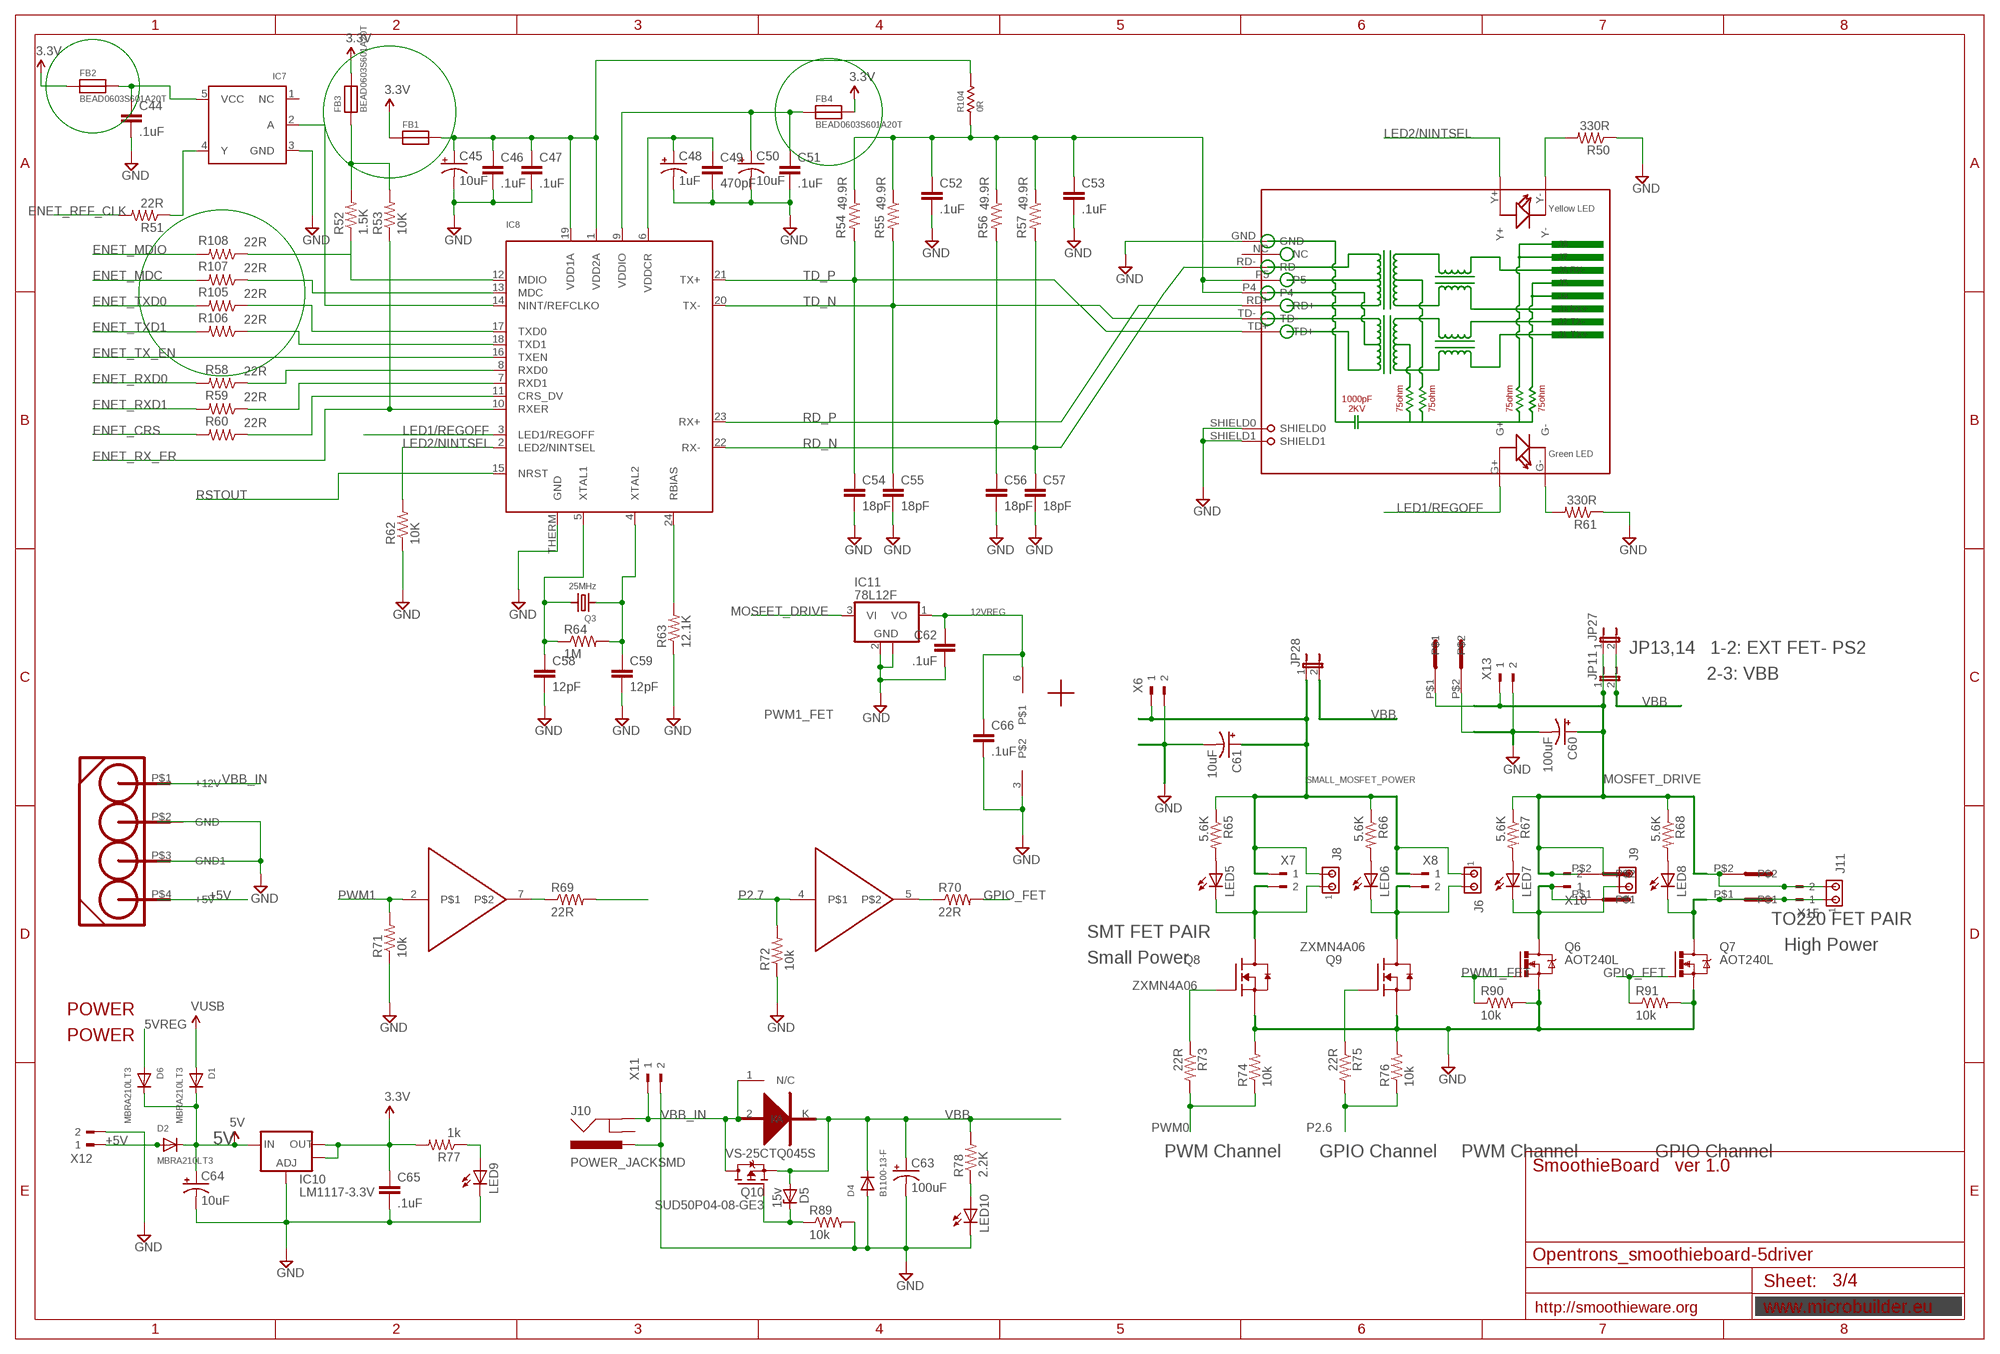
[diagram p2: schematic, sheet 3]

### Parts
C44  .1uF  C-EUC0603  [C0603]
C45  10uF  CAP_POL1206  [EIA3216]
C46  .1uF  C-EUC0603  [C0603]
C47  .1uF  C-EUC0603  [C0603]
C48  1uF  CAP_POL1206  [EIA3216]
C49  470pF  C-EUC0603K  [C0603K]
C50  10uF  CAP_POL1206  [EIA3216]
C51  .1uF  C-EUC0603  [C0603]
C52  .1uF  C-EUC0603  [C0603]
C53  .1uF  C-EUC0603  [C0603]
C54  18pF  C-EUC0603  [C0603]
C55  18pF  C-EUC0603  [C0603]
C56  18pF  C-EUC0603  [C0603]
C57  18pF  C-EUC0603  [C0603]
C58  12pF  C-EUC0603  [C0603]
C59  12pF  C-EUC0603  [C0603]
C60  100uF  CAP_POLE  [PANASONIC_E]
C61  10uF  CAP_POL1206  [EIA3216]
C62  .1uF  C-EUC0603  [C0603]
C63  100uF  CAP_POLD  [PANASONIC_D]
C64  10uF  CAP_POL1206  [EIA3216]
C65  .1uF  C-EUC0603  [C0603]
C66  .1uF  C-EUC0603  [C0603]
D1  MBRA210LT3  DIODESMA  [SMADIODE]
D2  MBRA210LT3  DIODESMA  [SMADIODE]
D3  VS-25CTQ045S  ETH1506S  [TO263AB]
D4  B1100-13-F  DIODESMA  [SMADIODE]
D5  15v  ZENER-DIODESMB  [SMB]
D6  MBRA210LT3  DIODESMA  [SMADIODE]
FB1  FERRITE  [0603]
FB2  BEAD0603S601A20T  FERRITE  [0603]
FB3  BEAD0603S601A20T  FERRITE  [0603]
FB4  BEAD0603S601A20T  FERRITE  [0603]
IC7  74LVC1G04  [SOT23-5]
IC8  LAN8720  [QFN24_4MM]
IC10  LM1117-3.3V  V_REG_LM1117SOT223  [SOT223]
IC11  78L12F  [SOT89]
IC14  TC4427  [SOIC8]
J6  MTA02-100  [10X02MTA]
J8  MTA02-100  [10X02MTA]
J9  MTA02-100  [10X02MTA]
J10  POWER_JACKSMD  [POWER_JACK_SMD]
J11  MTA02-100  [10X02MTA]
JP11  JP1E  [JP1]
JP27  JP1E  [JP1]
JP28  JP1E  [JP1]
LED5  LEDCHIP-LED0805  [CHIP-LED0805]
LED6  LEDCHIP-LED0805  [CHIP-LED0805]
LED7  LEDCHIP-LED0805  [CHIP-LED0805]
LED8  LEDCHIP-LED0805  [CHIP-LED0805]
LED9  LEDCHIP-LED0805  [CHIP-LED0805]
LED10  LEDCHIP-LED0805  [CHIP-LED0805]
POWER  POWER  HDD-ATX_CON  [MOLEX8981]
Q3  25MHz  CRYSTALTHIN  [CRYSTAL_3.2X2.5]
Q6  AOT240L  IRF540  [TO220BV]
Q7  AOT240L  IRF540  [TO220BV]
Q8  ZXMN4A06  MOSFET-NCH_SOT-223  [SOT230P700X160-4N]
Q9  ZXMN4A06  MOSFET-NCH_SOT-223  [SOT230P700X160-4N]
Q10  SUD50P04-08-GE3  SPD30P06PTO252  [TO252]
R50  330R  R-US_R0603  [R0603]
R51  22R  R-US_R0603  [R0603]
R52  1.5K  R-US_R0603  [R0603]
R53  10K  R-US_R0603  [R0603]
R54  49.9R  R-US_R0603  [R0603]
R55  49.9R  R-US_R0603  [R0603]
R56  49.9R  R-US_R0603  [R0603]
R57  49.9R  R-US_R0603  [R0603]
R58  22R  R-US_R0603  [R0603]
R59  22R  R-US_R0603  [R0603]
R60  22R  R-US_R0603  [R0603]
R61  330R  R-US_R0603  [R0603]
R62  10K  R-US_R0603  [R0603]
R63  12.1K  R-US_R0603  [R0603]
R64  1M  R-US_R0603  [R0603]
R65  5.6K  R-US_R0603  [R0603]
R66  5.6K  R-US_R0603  [R0603]
R67  5.6K  R-US_R0603  [R0603]
R68  5.6K  R-US_R0603  [R0603]
R69  22R  R-US_R0603  [R0603]
R70  22R  R-US_R0603  [R0603]
R71  10k  R-US_R0603  [R0603]
R72  10k  R-US_R0603  [R0603]
R73  22R  R-US_R0603  [R0603]
R74  10k  R-US_R0603  [R0603]
R75  22R  R-US_R0603  [R0603]
R76  10k  R-US_R0603  [R0603]
R77  1k  R-US_R0603  [R0603]
R78  2.2K  R-US_R0603  [R0603]
R89  10k  R-US_R0603  [R0603]
R90  10k  R-US_R0603  [R0603]
R91  10k  R-US_R0603  [R0603]
R104  0R  RES0603  [0603(1608)]
R105  22R  R-US_R0603  [R0603]
R106  22R  R-US_R0603  [R0603]
R107  22R  R-US_R0603  [R0603]
R108  22R  R-US_R0603  [R0603]
RJ1  HR911105A  [HR911105A]
U$5  5MMCONN  [1715250000]
U$6  5MMCONN  [1715250000]
U$10  5MMCONN  [1715250000]
X6  180G-2  [180G-2]
X7  180G-2  [180G-2]
X8  180G-2  [180G-2]
X10  180G-2  [180G-2]
X11  180G-2  [180G-2]
X12  180G-2  [180G-2]
X13  180G-2  [180G-2]
X15  180G-2  [180G-2]

### Nets
3.3V: C65.1 FB1.1 FB2.1 FB3.2 FB4.2 IC10.2(OUT) IC10.4(OUT) R77.2 ; also sheet 1,2,4
5V: C64.A(+) D1.C D2.C D6.C IC10.3(IN) ; also sheet 1
5VREG: D6.A ; also sheet 4
12VREG: C62.1 C66.1 IC11.1(VO) IC14.6 ; also sheet 4
+5V: D2.A POWER.P$4(+5V) X12.1
ENET_CRS: R60.2 ; also sheet 1
ENET_MDC: R107.2 ; also sheet 1
ENET_MDIO: R108.2 ; also sheet 1
ENET_REF_CLK: R51.2 ; also sheet 1
ENET_RX_ER: IC8.10(RXER) R53.1 ; also sheet 1
ENET_RXD0: R58.2 ; also sheet 1
ENET_RXD1: R59.2 ; also sheet 1
ENET_TX_EN: IC8.16(TXEN) ; also sheet 1
ENET_TXD0: R105.2 ; also sheet 1
ENET_TXD1: R106.2 ; also sheet 1
GND: C44.2 C45.C(-) C46.2 C47.2 C48.C(-) C49.2 C50.C(-) C51.2 C52.2 C53.2 C54.2 C55.2 C56.2 C57.2 C58.2 C59.2 C60.- C61.C(-) C62.2 C63.- C64.C(-) C65.2 C66.2 D4.A IC7.3(GND) IC8.THERM(GND) IC10.1(ADJ) IC11.2(GND) IC11.2@1(GND) IC14.3 J10.VIN0(PWR) LED9.C LED10.C POWER.P$2(GND) POWER.P$3(GND1) Q6.S Q7.S Q8.3(S) Q9.3(S) R50.1 R61.1 R62.1 R63.1 R71.1 R72.1 R74.2 R76.2 R89.2 R90.2 R91.2 RJ1.GND RJ1.SHIELD0 RJ1.SHIELD1 U$5.P$2 X6.2 X11.2 X12.2 X13.2 ; also sheet 1,2,4
GPIO_FET: Q7.G R70.2 R91.1
LED1/REGOFF: IC8.3(LED1/REGOFF) RJ1.G+
LED2/NINTSEL: IC8.2(LED2/NINTSEL) R62.2 RJ1.Y+
MOSFET_DRIVE: C60.+ IC11.3(VI) J9.2 J11.2 JP11.1 JP27.1 R67.1 R68.1 U$5.P$1 U$6.P$2 U$10.P$2 X10.2 X13.1 X15.2
N$5: IC14.7 R69.1
N$16: LED10.A R78.1
N$18: J6.2 LED6.C Q9.4(D) X8.2
N$19: IC14.5 R70.1
N$20: R61.2 RJ1.G-
N$21: C52.1 C53.1 R54.1 R55.1 R56.1 R57.1 R104.1 RJ1.P4 RJ1.P5
N$42: IC8.8(RXD0) R58.1
N$47: R50.2 RJ1.Y-
N$55: IC8.7(RXD1) R59.1
N$63: IC8.11(CRS_DV) R60.1
N$67: C59.1 IC8.4(XTAL2) Q3.1 R64.2
N$68: C58.1 IC8.5(XTAL1) Q3.2 R64.1
N$69: IC8.24(RBIAS) R63.2
N$74: Q8.1(G) R73.1
N$75: Q9.1(G) R75.1
N$77: IC7.2(A) IC8.14(NINT/REFCLKO)
N$78: IC7.4(Y) R51.1
N$80: LED9.A R77.1
N$81: LED5.A R65.2
N$82: C48.A(+) C49.1 IC8.6(VDDCR)
N$88: J8.1 LED5.C Q8.4(D) X7.2
N$91: LED6.A R66.2
N$92: J9.1 LED7.C Q6.D U$10.P$1 X10.1
N$94: J11.1 LED8.C Q7.D U$6.P$1 X15.1
N$105: LED7.A R67.2
N$111: D5.C Q10.1(G) R89.1
N$112: LED8.A R68.2
N$144: C44.1 FB2.2 IC7.5(VCC)
N$147: FB3.1 R52.2 R53.2
N$148: C50.A(+) C51.1 FB4.1 IC8.9(VDDIO)
N$149: C45.A(+) C46.1 C47.1 FB1.2 IC8.1(VDD2A) IC8.19(VDD1A) R104.2
N$162: IC8.17(TXD0) R105.1
N$163: IC8.18(TXD1) R106.1
N$164: IC8.12(MDIO) R52.1 R108.1
N$165: IC8.13(MDC) R107.1
P2.6: R75.2 R76.1 ; also sheet 1
P2.7: IC14.4 R72.2 ; also sheet 1
PWM0: R73.2 R74.1 ; also sheet 1
PWM1: IC14.2 R71.2 ; also sheet 1
PWM1_FET: Q6.G R69.2 R90.1
RD_N: C57.1 IC8.22(RX-) R57.2 RJ1.RD-
RD_P: C56.1 IC8.23(RX+) R56.2 RJ1.RD+
RSTOUT: IC8.15(NRST) ; also sheet 1
SMALL_MOSFET_POWER: C61.A(+) J6.1 J8.2 JP28.1 R65.1 R66.1 X6.1 X7.1 X8.1
TD_N: C55.1 IC8.20(TX-) R55.2 RJ1.TD-
TD_P: C54.1 IC8.21(TX+) R54.2 RJ1.TD+
VBB: C63.+ D3.K D4.C D5.A JP11.2 JP27.2 JP28.2 Q10.2(S) R78.2 ; also sheet 1,2,4
VBB_IN: D3.1(N/C) D3.2(A) J10.P$4(GND) POWER.P$1(+12V) Q10.3(D) X11.1
VUSB: D1.A ; also sheet 1
Unconnected: IC7.1(NC) J10.GND(GNDBREAK) RJ1.NC

### Notes on the sheet
- JP13,14   1-2: EXT FET- PS2
- 2-3: VBB
- TO220 FET PAIR
- SMT FET PAIR
- High Power
- Small Power
- VS-25CTQ045S | PWM Channel | GPIO Channel | PWM Channel | GPIO Channel
- SmoothieBoard   ver 1.0
- http://smoothieware.org

## Sheet 4 of 4
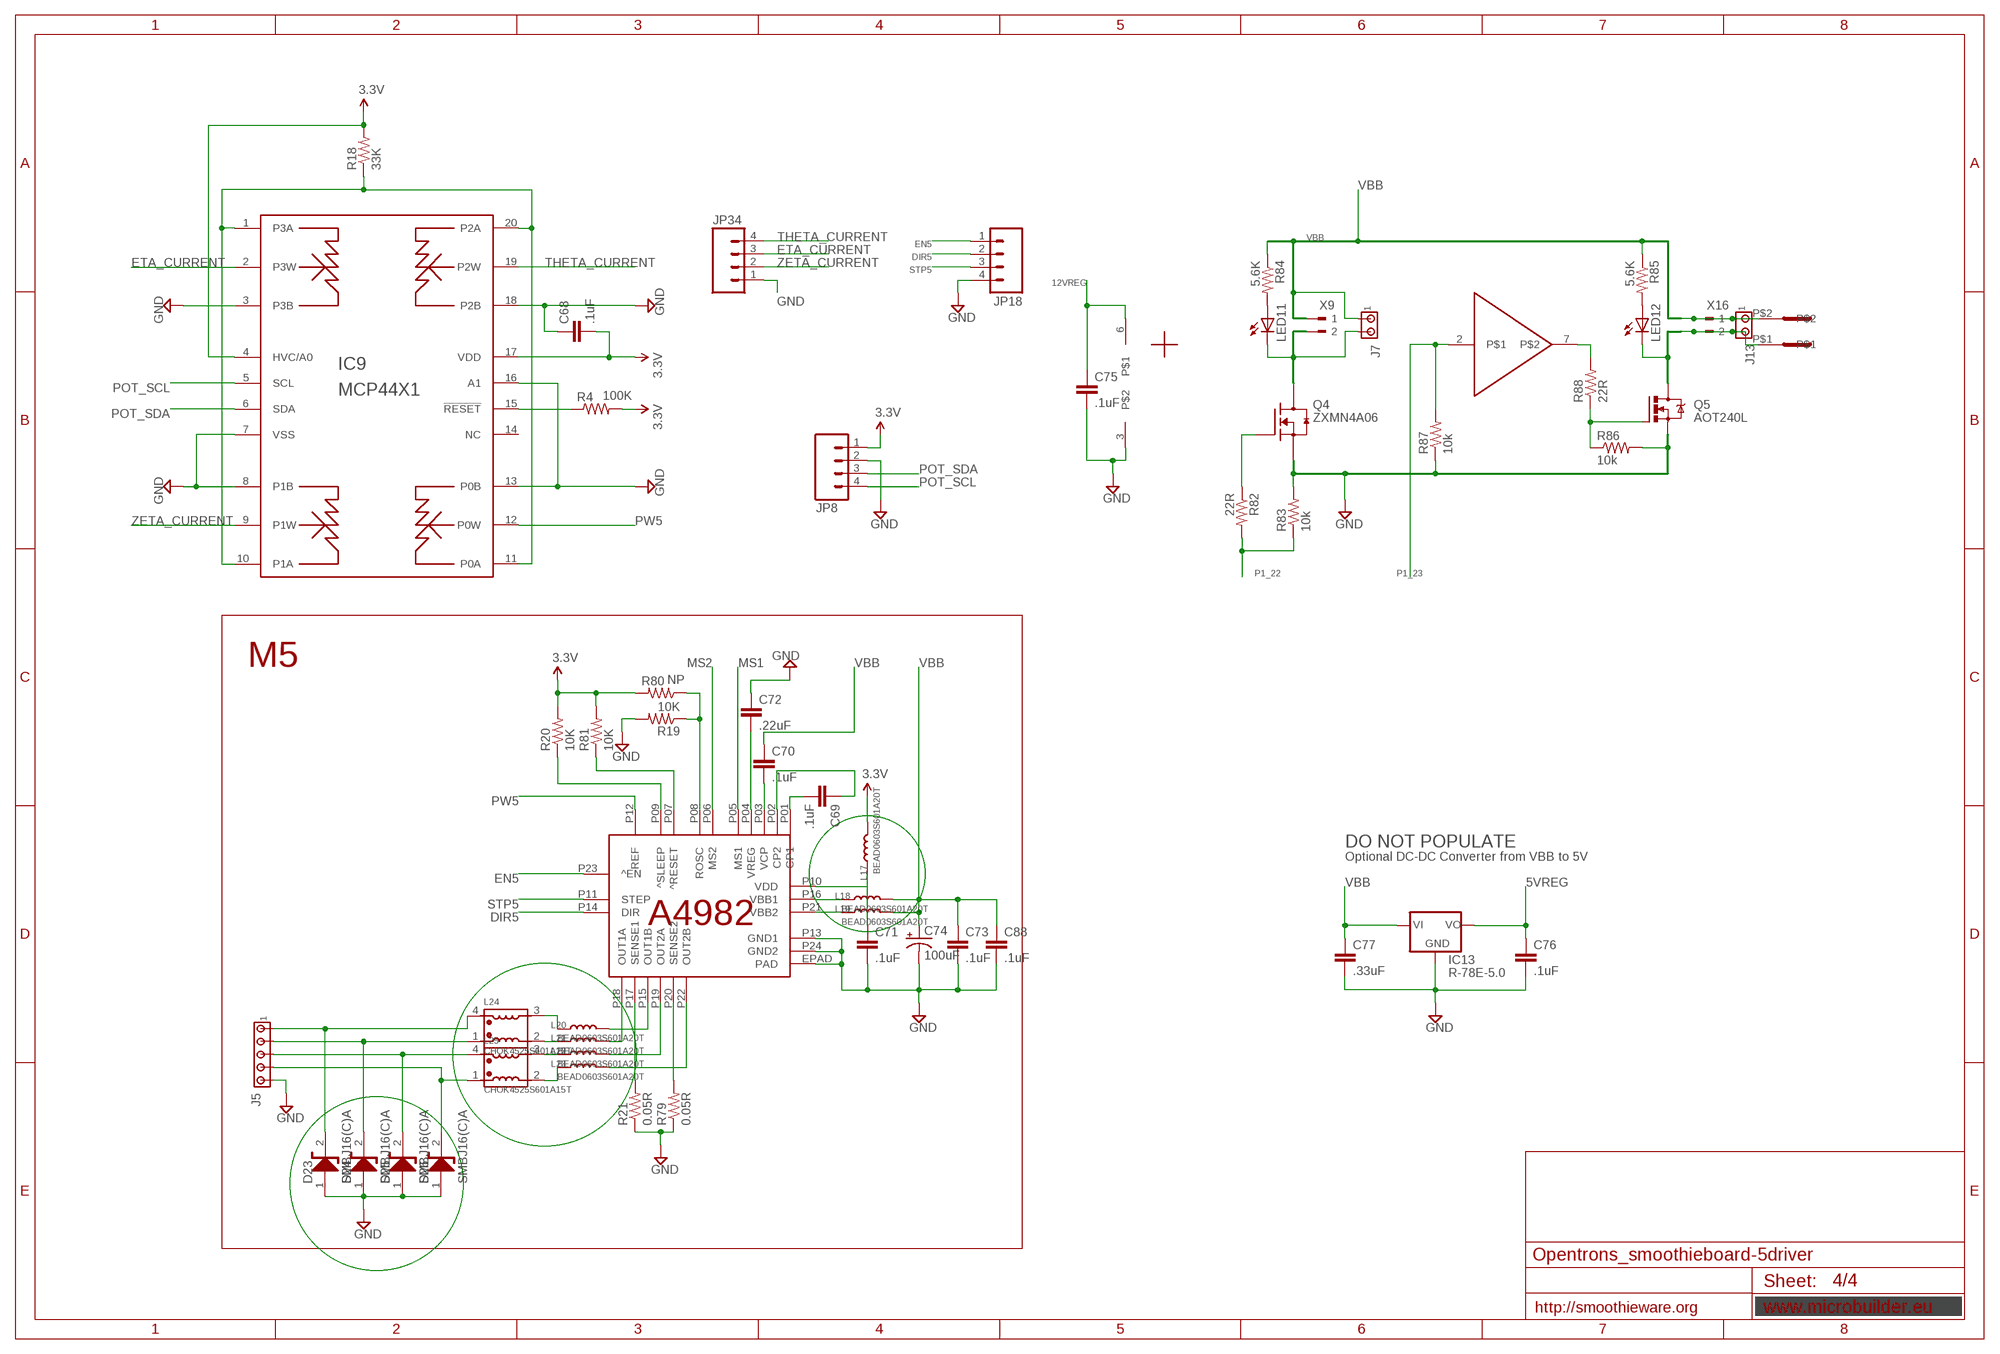
[diagram p3: schematic, sheet 4]

### Parts
C68  .1uF  C-EUC0603  [C0603]
C69  .1uF  C-EUC0603  [C0603]
C70  .1uF  C-EUC0603  [C0603]
C71  .1uF  C-EUC0603  [C0603]
C72  .22uF  C-EUC0603  [C0603]
C73  .1uF  C-EUC0603  [C0603]
C74  100uF  CAP_POLE  [PANASONIC_E]
C75  .1uF  C-EUC0603  [C0603]
C76  .1uF  C-EUC0603  [C0603]
C77  .33uF  C-EUC0603  [C0603]
C88  .1uF  C-EUC0603  [C0603]
D23  SMBJ16(C)A  [DO214-AA_(SMB)]
D24  SMBJ16(C)A  [DO214-AA_(SMB)]
D25  SMBJ16(C)A  [DO214-AA_(SMB)]
D26  SMBJ16(C)A  [DO214-AA_(SMB)]
IC9  MCP44X1  [TSSOP20]
IC12  A4982  [ETSSOP24]
IC13  R-78E-5.0  R-78  [R-78]
IC15  TC4427  [SOIC8]
J5  MTA05-100  [10X05MTA]
J7  MTA02-100  [10X02MTA]
J13  MTA02-100  [10X02MTA]
JP8  M041X04_NO_SILK  [1X04_NO_SILK]
JP18  M041X04_NO_SILK  [1X04_NO_SILK]
JP34  M041X04_NO_SILK  [1X04_NO_SILK]
L17  BEAD0603S601A20T  INDOUCTOR0603  [0603(1608)]
L18  BEAD0603S601A20T  INDOUCTOR0603  [0603(1608)]
L19  BEAD0603S601A20T  INDOUCTOR0603  [0603(1608)]
L20  BEAD0603S601A20T  INDOUCTOR0603  [0603(1608)]
L21  BEAD0603S601A20T  INDOUCTOR0603  [0603(1608)]
L22  BEAD0603S601A20T  INDOUCTOR0603  [0603(1608)]
L23  BEAD0603S601A20T  INDOUCTOR0603  [0603(1608)]
L24  CHOK4525S601A15T  CHOK-4525S-XXX  [L-4525]
L25  CHOK4525S601A15T  CHOK-4525S-XXX  [L-4525]
LED11  LEDCHIP-LED0805  [CHIP-LED0805]
LED12  LEDCHIP-LED0805  [CHIP-LED0805]
Q4  ZXMN4A06  MOSFET-NCH_SOT-223  [SOT230P700X160-4N]
Q5  AOT240L  IRF540  [TO220BV]
R4  100K  R-US_R0603  [R0603]
R18  33K  R-US_R0603  [R0603]
R19  10K  R-US_R0603  [R0603]
R20  10K  R-US_R0603  [R0603]
R21  0.05R  RESISTOR2512  [R2512]
R79  0.05R  RESISTOR2512  [R2512]
R80  NP  R-US_R0603  [R0603]
R81  10K  R-US_R0603  [R0603]
R82  22R  R-US_R0603  [R0603]
R83  10k  R-US_R0603  [R0603]
R84  5.6K  R-US_R0603  [R0603]
R85  5.6K  R-US_R0603  [R0603]
R86  10k  R-US_R0603  [R0603]
R87  10k  R-US_R0603  [R0603]
R88  22R  R-US_R0603  [R0603]
U$7  5MMCONN  [1715250000]
X9  180G-2  [180G-2]
X16  180G-2  [180G-2]

### Nets
3.3V: C68.2 IC9.4(HVC/A0) IC9.17(VDD) JP8.1 L17.2 R4.2 R18.2 R20.2 R80.2 R81.2 ; also sheet 1,2,3
5VREG: C76.1 IC13.3(VO) ; also sheet 3
12VREG: C75.1 IC15.6 ; also sheet 3
DIR5: IC12.P14(DIR) JP18.2 ; also sheet 1
EN5: IC12.P23(^EN) JP18.1 ; also sheet 1
ETA_CURRENT: IC9.2(P3W) JP34.3
GND: C68.1 C71.2 C72.1 C73.2 C74.- C75.2 C76.2 C77.2 C88.2 D23.1(A) D24.1(A) D25.1(A) D26.1(A) IC9.3(P3B) IC9.7(VSS) IC9.8(P1B) IC9.13(P0B) IC9.16(A1) IC9.18(P2B) IC12.EPAD(PAD) IC12.P13(GND1) IC12.P24(GND2) IC13.2(GND) IC15.3 J5.5 JP8.2 JP18.4 JP34.1 Q4.3(S) Q5.S R19.2 R21.1 R79.1 R83.2 R86.2 R87.1 ; also sheet 1,2,3
GPIO_FET1: Q5.G R86.1 R88.1
J5_1A: D23.2(K) J5.1 L24.4
J5_1B: D24.2(K) J5.2 L24.1
J5_2A: D25.2(K) J5.3 L25.4
J5_2B: D26.2(K) J5.4 L25.1
MS1: IC12.P05(MS1) ; also sheet 2
MS2: IC12.P06(MS2) ; also sheet 2
N$29: IC9.15(!RESET) R4.1
N$52: J7.2 LED11.C Q4.4(D) X9.2
N$56: IC9.1(P3A) IC9.10(P1A) IC9.11(P0A) IC9.20(P2A) R18.1
N$58: C69.2 IC12.P01(CP1)
N$59: C69.1 IC12.P02(CP2)
N$64: C70.2 IC12.P03(VCP)
N$65: IC12.P17(SENSE1) R21.2
N$66: IC12.P20(SENSE2) R79.2
N$70: IC12.P18(OUT1A) L21.2
N$71: IC12.P15(OUT1B) L20.2
N$72: IC12.P19(OUT2A) L22.2
N$76: IC12.P22(OUT2B) L23.2
N$79: IC12.P08(ROSC) R19.1 R80.1
N$83: C72.2 IC12.P04(VREG)
N$89: IC12.P09(^SLEEP) R20.1
N$95: IC12.P07(^RESET) R81.1
N$97: Q4.1(G) R82.1
N$100: LED11.A R84.2
N$109: J13.2 LED12.C Q5.D U$7.P$1 X16.2
N$110: LED12.A R85.2
N$113: IC15.7 R88.2
N$141: C71.1 IC12.P10(VDD) L17.1
N$142: IC12.P16(VBB1) L18.1
N$143: IC12.P21(VBB2) L19.1
N$145: L21.1 L24.2
N$146: L20.1 L24.3
N$150: L22.1 L25.3
N$151: L23.1 L25.2
P1_22: R82.2 R83.1 ; also sheet 1
P1_23: IC15.2 R87.2 ; also sheet 1
POT_SCL: IC9.5(SCL) JP8.4 ; also sheet 1,2
POT_SDA: IC9.6(SDA) JP8.3 ; also sheet 1,2
PW5: IC9.12(P0W) IC12.P12(REF)
STP5: IC12.P11(STEP) JP18.3 ; also sheet 1
THETA_CURRENT: IC9.19(P2W) JP34.4
VBB: C70.1 C73.1 C74.+ C77.1 C88.1 IC13.1(VI) J7.1 J13.1 L18.2 L19.2 R84.1 R85.1 U$7.P$2 X9.1 X16.1 ; also sheet 1,2,3
ZETA_CURRENT: IC9.9(P1W) JP34.2
Unconnected: IC9.14(NC) IC15.4 IC15.5

### Notes on the sheet
- M5
- DO NOT POPULATE
- Optional DC-DC Converter from VBB to 5V
- http://smoothieware.org

## Library data of the parts
C1 C44 C46 C47 C49 C51-C59 C62 C65-C67 C75 = resistor:C-EU: CAPACITOR, European symbol
C2-C6 C8-C20 C25 C27 C28 C30-C38 C40 C41 C43 C68-C73 C76-C88 = rcl:C-EU: CAPACITOR, European symbol
C7 C21-C24 C26 C29 C39 C42 C45 C48 C50 C60 C61 C63 C64 C74 = SparkFun:CAP_POL: Capacitor Polarized These are standard SMD and PTH capacitors. Normally 10uF, 47uF, and 100uF in electrolytic and tantalum varieties. Always verify the external diameter of the through hole cap, it varies with capacity, voltage, and manufacturer. The EIA devices should be standard.
D1 D2 D4 D6 = microbuilder:DIODE: Diode SMADIODE - SMA Surface Mount Package 20V 1A Schottky Diode Digikey (500mV @ 1A, 500uA Vr @ 20V): 641-1014-6-ND 10V 2A Schottky Diode Digikey (350mV @ 2A, 700uA Vr @ 10V): MBRA210LT3 SOD-123 30V 200mA (800mV Vf, 2uA Vr @ 25V) Schottky Diode (very fast switching for boost, etc.) - Digikey: BAT54T1GOSTR-ND 30V 500mA (430mV Vf, 130uA Vr @ 30V) Schottky Diode - Digikey: B0530W-FDICT-ND MBR120 1A 20V (0.34Vf) Schottky Diode - Digikey: MBR120VLSFT1GOSCT-ND SOD-323 10V 570mA (380mV Vf, 3ns) Schottky Diode - Digikey: ZLLS410CT-ND 1N4148WS - 75V 150mA (1V Vf @ 10mA, 4ns) Simple Diode - Digikey: 1N4148WSFSCT-ND, Mouser: 512-1N4148WS SOD-523 BAT54 30V 200mA Schottky (0.8 Vf @ 100mA, 5ns) - Digikey: BAT54XV2CT-ND 30V 30mA Schottky Diode (RB751S-40TE61) - Digikey: RB751S-40TE61CT-ND SOT23-R/W - SOT23 Package (R = Solder Paste/Reflow Ovens, W = Hand-Soldering) BAT54Film 40V 300mA - Digikey: 497-7162-1-ND DO-1N4148 Through Hole Small Current Diode (any model)
D3 = Geos:ETH1506S: ETH1506S Package : TO-263AB (D2PAK), TO-262AA IF(AV) : 15 A VR : 600 V Hyperfast Rectifier, 15 A FRED Pt Diode variation Single die
D5 = diode:ZENER-DIODE: Z-Diode
D7-D26 = My_Lib:SMBJ16
FB1-FB4 = microbuilder:FERRITE: Ferrite Bead 0603 MMZ1608B121C - 120 Ohm, 600mA Ferrite Chip - Digikey: 445-2164-1-ND BK1608HW121-T - 120 Ohm, 600mA Ferrite Chip - Digikey: 587-1876-2-ND
IC1 = microbuilder:LPC1768: LPC1768 100 MHz 32-bit ARM Cortex-M3 based microcontroller featuring a high level of integration and low power consumption. 512 kB Flash, 64 kB SRAM, USB Device/Host/OTG, Ethernet, CAN, I2S, 10-bit DAC Digikey: 568-4796-ND
IC2 IC3 IC5 IC6 IC12 = A4982:A4982
IC4 IC9 = Geos:MCP44X1: MCP44x1 MCP4451 - ? Quad Resistor Network ? I2C Serial Interface Support ? Potentiometer or Rheostat Configuration Options ? Resistor Network Resolution: 7-bit ? 128 Resistors (129 Taps) 8-bit ? 256 Resistors (257 Taps)
IC7 = microbuilder:74LVC1G04: 74LVC1G04 - Single Inverter Gate SOT23-5 SN74LVC1G04DBVR - Digikey: 296-11599-1-ND
IC8 = microbuilder:LAN8720: LAN8720A 10/100 Ethernet PHY Mouser: 886-LAN8720AI-CP
IC10 = SparkFun:V_REG_LM1117: Voltage Regulator LM1117 Standard adjustable voltage regulator but in SMD form. Spark Fun Electronics SKU : COM-00595
IC11 = linear:78L*: POSITOIV-VOLTAGE REGULATORS Output up to 100 mA Source: http://focus.ti.com/lit/ds/symlink/ua78l05.pdf
IC13 = logxen:R-78
IC14 IC15 = custom_esorensen:TC4427
J1-J5 = con-amp:MTA05-100: AMP connector
J6-J9 J11 J13 = con-amp:MTA02-100: AMP connector
J10 = SparkFun:POWER_JACK: Power Jack This is the standard 5.5mm barrel jack for power. The PTH is the most common, proven, reliable, footprint. All others are experimental. The Slot footprint only works if the mill layer is transmitted to the PCB fab house so be warned. Spark Fun Electronics SKU : PRT-00119. Mating wall wart : TOL-00298 (and others)
JP1 JP7-JP10 JP12 JP15 JP18 JP29 JP34 = SparkFun:M04: Header 4 Standard 4-pin 0.1" header. Use with straight break away headers (SKU : PRT-00116), right angle break away headers (PRT-00553), swiss pins (PRT-00743), machine pins (PRT-00117), and female headers (PRT-00115). Molex polarized connector foot print use with SKU : PRT-08231 with associated crimp pins and housings. 1MM SMD Version SKU: PRT-10208
JP2-JP4 JP6 JP14 JP16 JP17 JP19-JP22 JP26 = SparkFun:M03: Header 3 Standard 3-pin 0.1" header. Use with straight break away headers (SKU : PRT-00116), right angle break away headers (PRT-00553), swiss pins (PRT-00743), machine pins (PRT-00117), and female headers (PRT-00115). Molex polarized connector foot print use with SKU : PRT-08232 with associated crimp pins and housings.
JP5 = SparkFun:M06: Header 6 Standard 6-pin 0.1" header. Use with straight break away headers (SKU : PRT-00116), right angle break away headers (PRT-00553), swiss pins (PRT-00743), machine pins (PRT-00117), and female headers (PRT-00115). Molex polarized connector foot print use with SKU : PRT-08094 with associated crimp pins and housings. NOTES ON THE VARIANTS LOCK and LOCK_LONGPADS... This footprint was designed to help hold the alignment of a through-hole component (i.e. 6-pin header) while soldering it into place. You may notice that each hole has been shifted either up or down by 0.005 of an inch from it's more standard position (which is a perfectly straight line). This slight alteration caused the pins (the squares in the middle) to touch the edges of the holes. Because they are alternating, it causes a "brace" to hold the component in place. 0.005 has proven to be the perfect amount of "off-center" position when using our standard breakaway headers. Although looks a little odd when you look at the bare footprint, once you have a header in there, the alteration is very hard to notice. Also, if you push a header all the way into place, it is covered up entirely on the bottom side. This idea of altering the position of holes to aid alignment will be further integrated into the Sparkfun Library for other footprints. It can help hold any component with 3 or more connection pins.
JP11 JP27 JP28 = jumper:JP1E: JUMPER
JP23 JP24 = SparkFun:M02: Header 2 Standard 2-pin 0.1" header. Use with straight break away headers (SKU : PRT-00116), right angle break away headers (PRT-00553), swiss pins (PRT-00743), machine pins (PRT-00117), and female headers (PRT-00115). Molex polarized connector foot print use with SKU : PRT-08233 with associated crimp pins and housings.
JP25 = SparkFun-Connectors:M03: Header 3 Standard 3-pin 0.1" header. Use with straight break away headers (SKU : PRT-00116), right angle break away headers (PRT-00553), swiss pins (PRT-00743), machine pins (PRT-00117), and female headers (PRT-00115). Molex polarized connector foot print use with SKU : PRT-08232 with associated crimp pins and housings.
JP30 JP31 = SparkFun:JUMPER-2: Jumper Basic 0.1" spaced jumper. Use with breakaway headers.
JP32 JP33 = SparkFun:M05: Header 5 Standard 5-pin 0.1" header. Use with straight break away headers (SKU : PRT-00116), right angle break away headers (PRT-00553), swiss pins (PRT-00743), machine pins (PRT-00117), and female headers (PRT-00115). Molex polarized connector foot print use with SKU : PRT-08230 with associated crimp pins and housings.
L1 = SparkFun:INDUCTOR: Inductors Basic Inductor/Choke - 0603 and 1206. Footprints are not proven and vary greatly between part numbers.
L2 L3 L5-L23 L26-L29 L32-L35 L38-L41 L44-L47 = My_Lib:INDOUCTOR
L4 L24 L25 L30 L31 L36 L37 L42 L43 L48 L49 = My_Lib:CHOK-
LED1-LED12 = led:LED: LED OSRAM: - CHIPLED LG R971, LG N971, LY N971, LG Q971, LY Q971, LO R971, LY R971 LH N974, LH R974 LS Q976, LO Q976, LY Q976 LO Q996 - Hyper CHIPLED LW Q18S LB Q993, LB Q99A, LB R99A - SideLED LS A670, LO A670, LY A670, LG A670, LP A670 LB A673, LV A673, LT A673, LW A673 LH A674 LY A675 LS A676, LA A676, LO A676, LY A676, LW A676 LS A679, LY A679, LG A679 - Hyper Micro SIDELED® LS Y876, LA Y876, LO Y876, LY Y876 LT Y87S - SmartLED LW L88C, LW L88S LB L89C, LB L89S, LG L890 LS L89K, LO L89K, LY L89K LS L896, LA L896, LO L896, LY L896 - TOPLED LS T670, LO T670, LY T670, LG T670, LP T670 LSG T670, LSP T670, LSY T670, LOP T670, LYG T670 LG T671, LOG T671, LSG T671 LB T673, LV T673, LT T673, LW T673 LH T674 LS T676, LA T676, LO T676, LY T676, LB T676, LH T676, LSB T676, LW T676 LB T67C, LV T67C, LT T67C, LS T67K, LO T67K, LY T67K, LW E67C LS E67B, LA E67B, LO E67B, LY E67B, LB E67C, LV E67C, LT E67C LW T67C LS T679, LY T679, LG T679 LS T770, LO T770, LY T770, LG T770, LP T770 LB T773, LV T773, LT T773, LW T773 LH T774 LS E675, LA E675, LY E675, LS T675 LS T776, LA T776, LO T776, LY T776, LB T776 LHGB T686 LT T68C, LB T68C - Hyper Mini TOPLED® LB M676 - Mini TOPLED Santana® LG M470 LS M47K, LO M47K, LY M47K Source: http://www.osram.convergy.de LUXEON: - LUMILED® LXK2-PW12-R00, LXK2-PW12-S00, LXK2-PW14-U00, LXK2-PW14-V00 LXK2-PM12-R00, LXK2-PM12-S00, LXK2-PM14-U00 LXK2-PE12-Q00, LXK2-PE12-R00, LXK2-PE12-S00, LXK2-PE14-T00, LXK2-PE14-U00 LXK2-PB12-K00, LXK2-PB12-L00, LXK2-PB12-M00, LXK2-PB14-N00, LXK2-PB14-P00, LXK2-PB14-Q00 LXK2-PR12-L00, LXK2-PR12-M00, LXK2-PR14-Q00, LXK2-PR14-R00 LXK2-PD12-Q00, LXK2-PD12-R00, LXK2-PD12-S00 LXK2-PH12-R00, LXK2-PH12-S00 LXK2-PL12-P00, LXK2-PL12-Q00, LXK2-PL12-R00 Source: www.luxeon.com KINGBRIGHT: KA-3528ASYC Source: www.kingbright.com
POWER = Geos:HDD-ATX_CON: ATX HDD Connector 4 pin Molex8981 Connector; J: ATX-HDD
Q1 = transistor-fet:BSL207SP: OptiMOS(R)-P Small-Signal-Transistor P-Channel, Enhancement mode, Super Logic Level (2.5 V rated) Source: http://www.infineon.com/upload/Document/BSL207SP_Rev2.01.pdf
Q2 Q3 = microbuilder:CRYSTAL: Crystals HC49UP - Surface Mount Crystal 4.0MHz 18pF +/-30ppm Surface Mount Crystal [Digikey: 535-9857-1-ND] 12.0 MHz Surface Mount Crystal [Digikey: 535-9869-6-ND] 25.0 MHz Surface Mount Crystal [Digikey: 535-9078-1-ND] 3.2 x 2.5mm - MEMs SMT Crystal 12.0 MHz 8pF 15ppm 3.2 x 2.5mm Crystal [Digikey: -10-70°C: 644-1047-1-ND -40-125°C: 644-1128-1-ND] 16.0 MHz 8pF 15ppm 3.2 x 2.5mm Crystal [Digikey: -10-70°C: 644-1049-1-ND -40-125°C: 644-1129-2-ND] 16.0 MHz 10pF 10ppm 3.2 x 2.5mm Crystal [Digikey: 644-1100-1-ND] 27.12 MHz 18pF 30ppm 3.2 x 2.5mm Crystal [Digikey: 887-1424-1-ND] 27.12MHz 10pF 10ppm 3.2 x 2.5mm Crystal [Digikey: 887-1329-1-ND] 4.9 x 1.8mm - MEMs SMT Crystal 32.768 KHz 12.5pF 20ppm 4.9 x 1.8mm Crystal [Digikey: SE2415CT-ND] Cylinder 32.768KHz Cylinder Crystal
Q4 Q8 Q9 = ipc-7351-transistor:MOSFET-NCH_
Q5-Q7 = transistor-power:IRF540: HEXFET Power MOSFET
Q10 = transistor-fet:SPD30P06P: SIPMOS(R) Power-Transistor P-Channel, Enhancement mode Source: http://www.infineon.com/upload/Document/cmc_upload/documents/012/3615/SPD_U30P06P.pdf
R1-R20 R22-R30 R35-R45 R50-R78 R80-R103 R105-R108 = resistor:R-US_: RESISTOR, American symbol
R21 R31-R34 R46-R49 R79 = SparkFun:RESISTOR: Resistor Basic schematic elements and footprints for 0603, 1206, and PTH 1/10th watt (small) resistors.
R104 = My_Lib:RES
RJ1 = Itead_BP_110825.lbr:HR911105A: SOC006
RN1 = resistor-dil:4R-N: Array Chip Resistor Source: RS Component / Phycomp; OC_FARNELL: unknown; OC_NEWARK: unknown
S1 S2 = SparkFun:TAC_SWITCH: Momentary Switch Button commonly used for reset or general input. Spark Fun Electronics SKU : COM-00097
S3 = Local Library:SWITCH-MOMENTARY-LED
SJ1-SJ3 = SparkFun:SOLDERJUMPER_2WAY: Solder Jumper 2 way solder jumper
SL1 = con-amp-quick:M08: AMP QUICK CONNECTOR; OC_FARNELL: unknown; OC_NEWARK: unknown
U1 = SparkFun:USD-SOCKET: microSD Socket Push-push type uSD socket. Schematic element and footprint production proven. Spark Fun Electronics SKU : PRT-00127. tDoc lines correctly indicate media card edge positions when inserting (unlocked, locked, depressed).
U$5-U$7 U$10 = eric_sorensen:5MMCONN
U$8 U$9 = logxen:OSHW-LOGO: Open Source Hardware Logo This logo indicates the piece of hardware it is found on incorporates a OSHW license and/or adheres to the definition of open source hardware found here: http://freedomdefined.org/OSHW
X6-X13 X15 X16 = con-weidmueller-sl35:180G-2: WEIDMUELLER CLAMP CONNECTOR; OC_FARNELL: unknown; OC_NEWARK: unknown
X14 = SparkFun:USB: USB Connectors USB-B-PTH is fully proven SKU : PRT-00139 USB-miniB is fully proven SKU : PRT-00587 USB-A-PCB is untested. USB-A-H is throughly reviewed, but untested. Spark Fun Electronics SKU : PRT-00437 USB-B-SMT is throughly reviewed, but untested. Needs silkscreen touching up. USB-A-S has not been used/tested USB-MB-H has not been used/tested